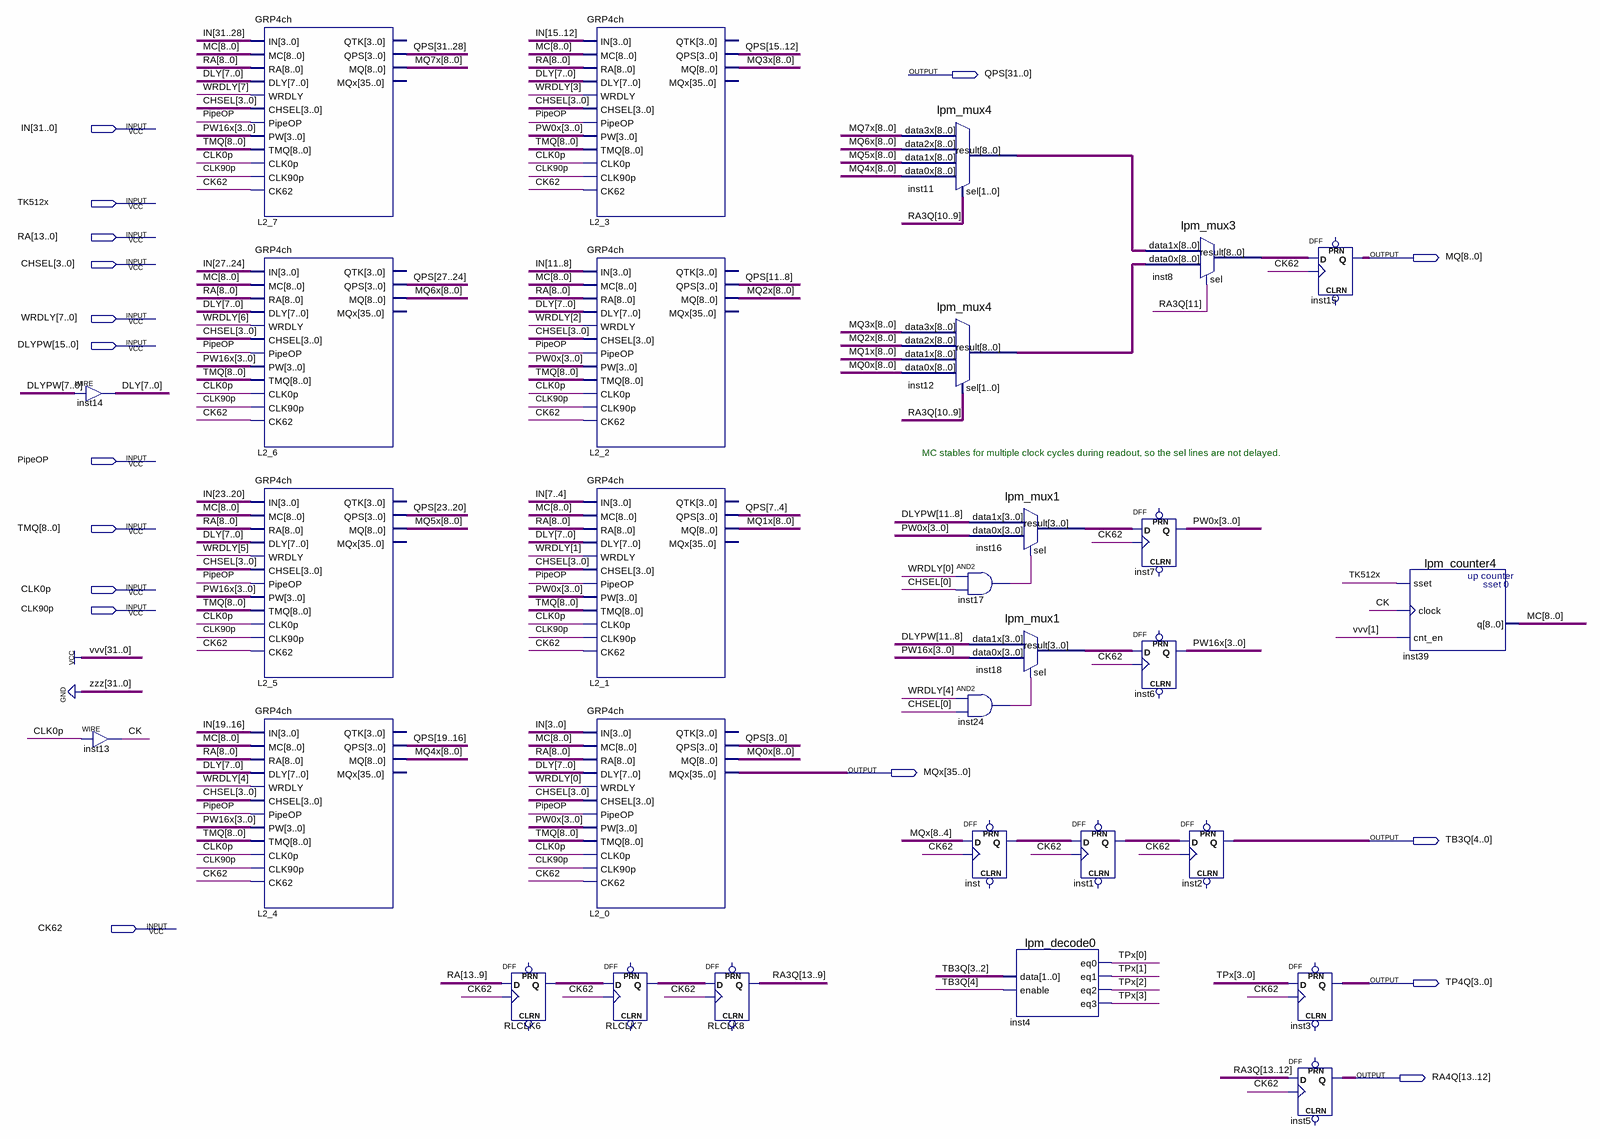
[diagram p0: schematic sheet]
// Quartus schematic GRP32ch.bdf as structural Verilog: 30 symbols, 17 pins
module GRP32ch (
  input  [31:0] IN,
  input  TK512x,
  input  [13:0] RA,
  input  [3:0] CHSEL,
  input  [7:0] WRDLY,
  input  [15:0] DLYPW,
  input  PipeOP,
  input  [8:0] TMQ,
  input  CLK0p,
  input  CLK90p,
  input  CK62,
  output [31:0] QPS,
  output [8:0] MQ,
  output [35:0] MQx,
  output [4:0] TB3Q,
  output [3:0] TP4Q,
  output [13:12] RA4Q
);

  wire CK, inst17_out, inst24_out;
  wire [3:0] inst16_result, inst18_result, PW0x, PW16x, TPx;
  wire [4:0] inst1_q, inst_q, RLCLK6_q, RLCLK7_q;
  wire [7:0] DLY;
  wire [8:0] inst8_result, inst11_result, inst12_result, MC, MQ0x, MQ1x, MQ2x, MQ3x, MQ4x, MQ5x, MQ6x, MQ7x;
  wire [13:9] RA3Q;

  assign DLY = DLYPW[7:0];  // WIRE inst14
  assign CK = CLK0p;  // WIRE inst13
  GRP4ch L2_7 (
    .IN(IN[31:28]), .MC(MC), .RA(RA[8:0]), .DLY(DLY), .WRDLY(WRDLY[7]), .CHSEL(CHSEL), .PipeOP(PipeOP),
    .PW(PW16x), .TMQ(TMQ), .CLK0p(CLK0p), .CLK90p(CLK90p), .CK62(CK62), .QPS(QPS[31:28]), .MQ(MQ7x));  // open: QTK, MQx
  GRP4ch L2_6 (
    .IN(IN[27:24]), .MC(MC), .RA(RA[8:0]), .DLY(DLY), .WRDLY(WRDLY[6]), .CHSEL(CHSEL), .PipeOP(PipeOP),
    .PW(PW16x), .TMQ(TMQ), .CLK0p(CLK0p), .CLK90p(CLK90p), .CK62(CK62), .QPS(QPS[27:24]), .MQ(MQ6x));  // open: QTK, MQx
  GRP4ch L2_5 (
    .IN(IN[23:20]), .MC(MC), .RA(RA[8:0]), .DLY(DLY), .WRDLY(WRDLY[5]), .CHSEL(CHSEL), .PipeOP(PipeOP),
    .PW(PW16x), .TMQ(TMQ), .CLK0p(CLK0p), .CLK90p(CLK90p), .CK62(CK62), .QPS(QPS[23:20]), .MQ(MQ5x));  // open: QTK, MQx
  GRP4ch L2_4 (
    .IN(IN[19:16]), .MC(MC), .RA(RA[8:0]), .DLY(DLY), .WRDLY(WRDLY[4]), .CHSEL(CHSEL), .PipeOP(PipeOP),
    .PW(PW16x), .TMQ(TMQ), .CLK0p(CLK0p), .CLK90p(CLK90p), .CK62(CK62), .QPS(QPS[19:16]), .MQ(MQ4x));  // open: QTK, MQx
  DFF RLCLK6[4:0] (.CLK(CK62), .D(RA[13:9]), .Q(RLCLK6_q));  // open: CLRN, PRN
  GRP4ch L2_3 (
    .IN(IN[15:12]), .MC(MC), .RA(RA[8:0]), .DLY(DLY), .WRDLY(WRDLY[3]), .CHSEL(CHSEL), .PipeOP(PipeOP),
    .PW(PW0x), .TMQ(TMQ), .CLK0p(CLK0p), .CLK90p(CLK90p), .CK62(CK62), .QPS(QPS[15:12]), .MQ(MQ3x));  // open: QTK, MQx
  GRP4ch L2_2 (
    .IN(IN[11:8]), .MC(MC), .RA(RA[8:0]), .DLY(DLY), .WRDLY(WRDLY[2]), .CHSEL(CHSEL), .PipeOP(PipeOP),
    .PW(PW0x), .TMQ(TMQ), .CLK0p(CLK0p), .CLK90p(CLK90p), .CK62(CK62), .QPS(QPS[11:8]), .MQ(MQ2x));  // open: QTK, MQx
  GRP4ch L2_1 (
    .IN(IN[7:4]), .MC(MC), .RA(RA[8:0]), .DLY(DLY), .WRDLY(WRDLY[1]), .CHSEL(CHSEL), .PipeOP(PipeOP),
    .PW(PW0x), .TMQ(TMQ), .CLK0p(CLK0p), .CLK90p(CLK90p), .CK62(CK62), .QPS(QPS[7:4]), .MQ(MQ1x));  // open: QTK, MQx
  GRP4ch L2_0 (
    .IN(IN[3:0]), .MC(MC), .RA(RA[8:0]), .DLY(DLY), .WRDLY(WRDLY[0]), .CHSEL(CHSEL), .PipeOP(PipeOP),
    .PW(PW0x), .TMQ(TMQ), .CLK0p(CLK0p), .CLK90p(CLK90p), .CK62(CK62), .QPS(QPS[3:0]), .MQ(MQ0x), .MQx(MQx));  // open: QTK
  DFF RLCLK7[4:0] (.CLK(CK62), .D(RLCLK6_q), .Q(RLCLK7_q));  // open: CLRN, PRN
  DFF RLCLK8[4:0] (.CLK(CK62), .D(RLCLK7_q), .Q(RA3Q));  // open: CLRN, PRN
  lpm_mux4 inst11 (
    .data3x(MQ7x), .data2x(MQ6x), .data1x(MQ5x), .data0x(MQ4x), .sel(RA3Q[10:9]), .result(inst11_result));
  lpm_mux4 inst12 (
    .data3x(MQ3x), .data2x(MQ2x), .data1x(MQ1x), .data0x(MQ0x), .sel(RA3Q[10:9]), .result(inst12_result));
  and inst17 (inst17_out, WRDLY[0], CHSEL[0]);
  and inst24 (inst24_out, WRDLY[4], CHSEL[0]);
  lpm_mux1 inst16 (.data1x(DLYPW[11:8]), .data0x(PW0x), .sel(inst17_out), .result(inst16_result));
  lpm_mux1 inst18 (.data1x(DLYPW[11:8]), .data0x(PW16x), .sel(inst24_out), .result(inst18_result));
  DFF inst[4:0] (.CLK(CK62), .D(MQx[8:4]), .Q(inst_q));  // open: CLRN, PRN
  lpm_decode0 inst4 (.data(TB3Q[3:2]), .enable(TB3Q[4]), .eq0(TPx[0]), .eq1(TPx[1]), .eq2(TPx[2]), .eq3(TPx[3]));
  DFF inst1[4:0] (.CLK(CK62), .D(inst_q), .Q(inst1_q));  // open: CLRN, PRN
  lpm_mux3 inst8 (.data1x(inst11_result), .data0x(inst12_result), .sel(RA3Q[11]), .result(inst8_result));
  DFF inst7[3:0] (.CLK(CK62), .D(inst16_result), .Q(PW0x));  // open: CLRN, PRN
  DFF inst6[3:0] (.CLK(CK62), .D(inst18_result), .Q(PW16x));  // open: CLRN, PRN
  DFF inst2[4:0] (.CLK(CK62), .D(inst1_q), .Q(TB3Q));  // open: CLRN, PRN
  DFF inst15[8:0] (.CLK(CK62), .D(inst8_result), .Q(MQ));  // open: CLRN, PRN
  DFF inst3[3:0] (.CLK(CK62), .D(TPx), .Q(TP4Q));  // open: CLRN, PRN
  DFF inst5[1:0] (.CLK(CK62), .D(RA3Q[13:12]), .Q(RA4Q));  // open: CLRN, PRN
  lpm_counter4 inst39 (.sset(TK512x), .clock(CK), .cnt_en(1'b1), .q(MC));

  // Notes on the sheet:
  //   MC stables for multiple clock cycles during readout, so the sel lines are not delayed.
endmodule
